# Altium schematic sheet homecomputer-6502_3.SchDoc: homecomputer-6502
size 286 x 202 mm; Date: 2018/12/4 21:08:27; SheetNumber: 4
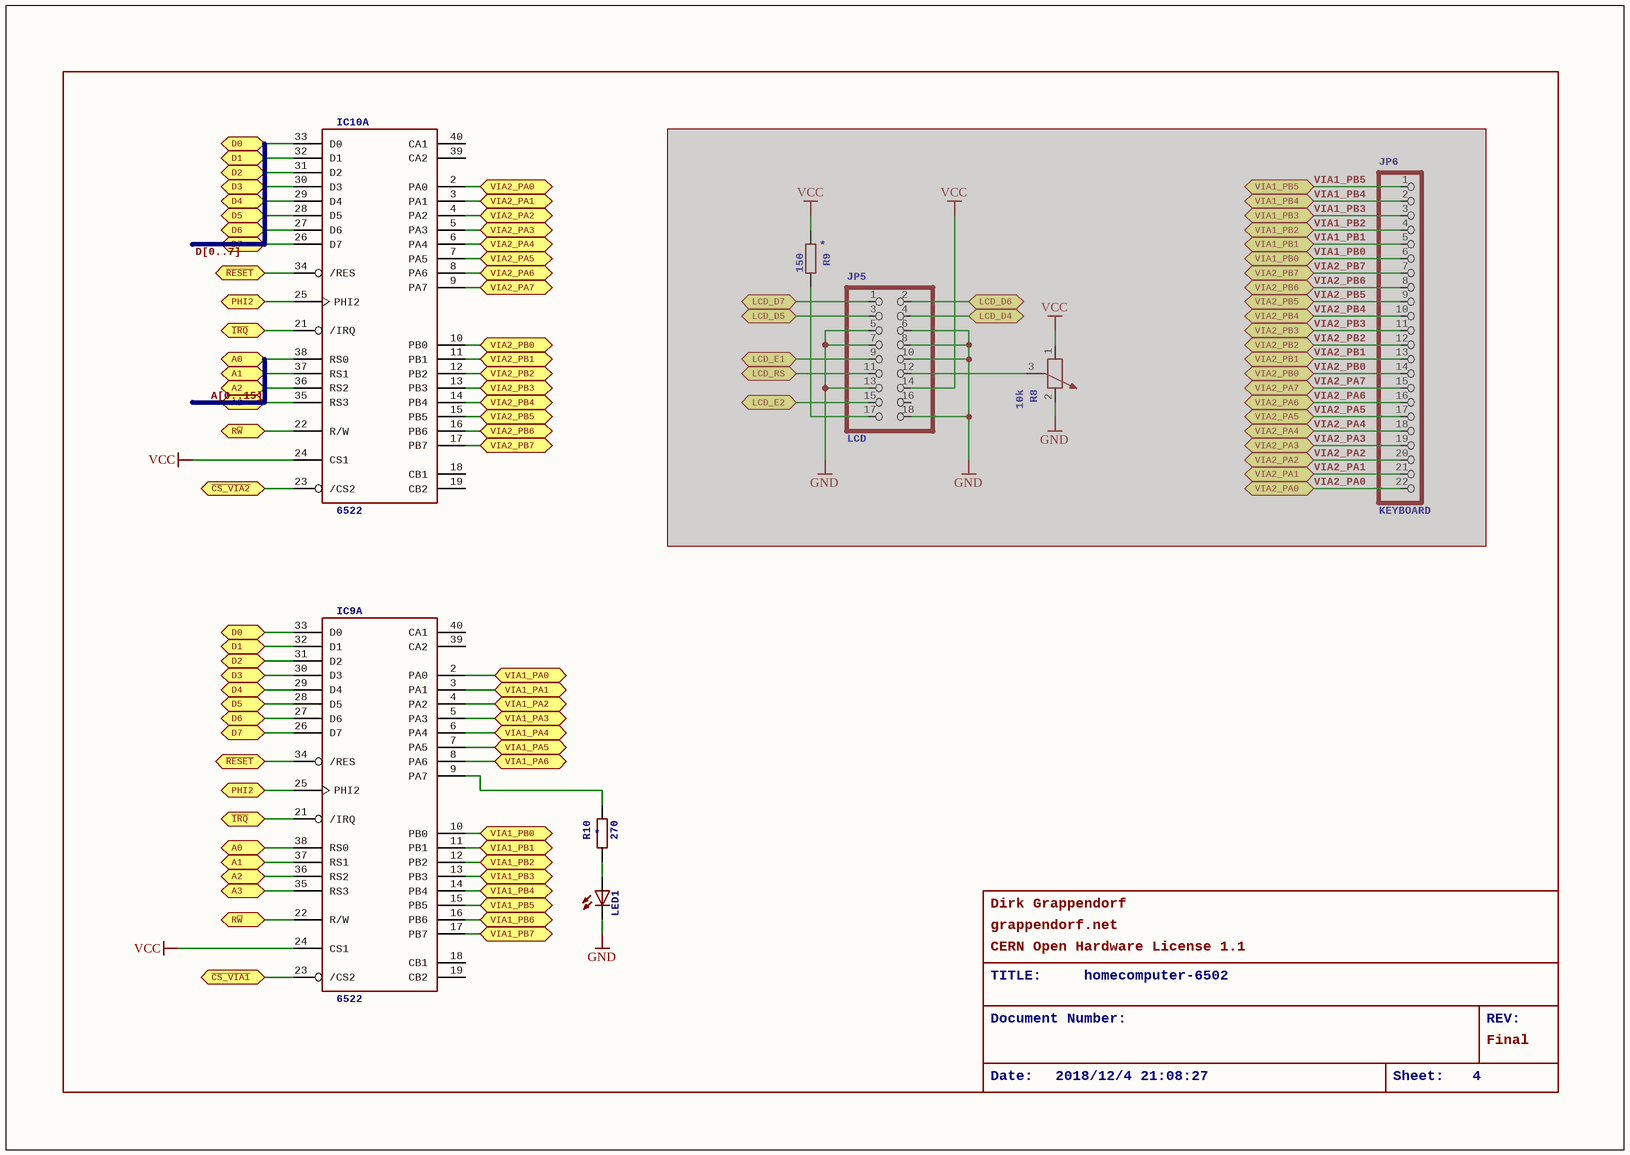
[diagram p0: homecomputer-6502_3.SchDoc]

## Parts
IC9  6522  [DIP40]  (part A of 2)
IC10  6522  [DIP40]  (part A of 2)
JP5  LCD  [2X09]  (masked out: inside a compile mask, not in the netlist)
JP6  KEYBOARD  [1X22]  (masked out: inside a compile mask, not in the netlist)
LED1  LED3MM  [LED3MM]  (value not drawn)
R8  10k  [PT-10]  (masked out: inside a compile mask, not in the netlist)
R9  150  [0204/7]  (masked out: inside a compile mask, not in the netlist)
R10  270  [0204/7]

## Ports
A0, A1, A2, A3, D0, D1, D2, D3, D4, D5, D6, D7, LCD_D4, LCD_D5, LCD_D6, LCD_D7, LCD_E1, LCD_E2, LCD_RS, PHI2, R~{W}, VIA1_PA0, VIA1_PA1, VIA1_PA2, VIA1_PA3, VIA1_PA4, VIA1_PA5, VIA1_PA6, VIA1_PB0, VIA1_PB1, VIA1_PB2, VIA1_PB3, VIA1_PB4, VIA1_PB5, VIA1_PB6, VIA1_PB7, VIA2_PA0, VIA2_PA1, VIA2_PA2, VIA2_PA3, VIA2_PA4, VIA2_PA5, VIA2_PA6, VIA2_PA7, VIA2_PB0, VIA2_PB1, VIA2_PB2, VIA2_PB3, VIA2_PB4, VIA2_PB5, VIA2_PB6, VIA2_PB7, ~{CS_VIA1}, ~{CS_VIA2}, ~{IRQ}, ~{RESET}

## Nets
GND: LED1.K(C)
VCC: IC9.24(CS1) IC10.24(CS1)
A0: IC9.38(RS0) IC10.38(RS0) ; port A0
A1: IC9.37(RS1) IC10.37(RS1) ; port A1
A3: IC9.35(RS3) IC10.35(RS3) ; port A3
A[0..15]: IC9.36(RS2) IC10.36(RS2) ; port A2
~{CS_VIA1}: IC9.23(/CS2) ; port ~{CS_VIA1}
~{CS_VIA2}: IC10.23(/CS2) ; port ~{CS_VIA2}
D0: IC9.33(D0) IC10.33(D0) ; port D0
D1: IC9.32(D1) IC10.32(D1) ; port D1
D2: IC9.31(D2) IC10.31(D2) ; port D2
D3: IC9.30(D3) IC10.30(D3) ; port D3
D4: IC9.29(D4) IC10.29(D4) ; port D4
D5: IC9.28(D5) IC10.28(D5) ; port D5
D6: IC9.27(D6) IC10.27(D6) ; port D6
D7: IC9.26(D7) IC10.26(D7) ; port D7
~{IRQ}: IC9.21(/IRQ) IC10.21(/IRQ) ; port ~{IRQ}
PHI2: IC9.25(PHI2) IC10.25(PHI2) ; port PHI2
~{RESET}: IC9.34(/RES) IC10.34(/RES) ; port ~{RESET}
R~{W}: IC9.22(R/W) IC10.22(R/W) ; port R~{W}
VIA1_PA0: IC9.2(PA0) ; port VIA1_PA0
VIA1_PA1: IC9.3(PA1) ; port VIA1_PA1
VIA1_PA2: IC9.4(PA2) ; port VIA1_PA2
VIA1_PA3: IC9.5(PA3) ; port VIA1_PA3
VIA1_PA4: IC9.6(PA4) ; port VIA1_PA4
VIA1_PA5: IC9.7(PA5) ; port VIA1_PA5
VIA1_PA6: IC9.8(PA6) ; port VIA1_PA6
VIA1_PB0: IC9.10(PB0) ; port VIA1_PB0
VIA1_PB1: IC9.11(PB1) ; port VIA1_PB1
VIA1_PB2: IC9.12(PB2) ; port VIA1_PB2
VIA1_PB3: IC9.13(PB3) ; port VIA1_PB3
VIA1_PB4: IC9.14(PB4) ; port VIA1_PB4
VIA1_PB5: IC9.15(PB5) ; port VIA1_PB5
VIA1_PB6: IC9.16(PB6) ; port VIA1_PB6
VIA1_PB7: IC9.17(PB7) ; port VIA1_PB7
VIA2_PA0: IC10.2(PA0) ; port VIA2_PA0
VIA2_PA1: IC10.3(PA1) ; port VIA2_PA1
VIA2_PA2: IC10.4(PA2) ; port VIA2_PA2
VIA2_PA3: IC10.5(PA3) ; port VIA2_PA3
VIA2_PA4: IC10.6(PA4) ; port VIA2_PA4
VIA2_PA5: IC10.7(PA5) ; port VIA2_PA5
VIA2_PA6: IC10.8(PA6) ; port VIA2_PA6
VIA2_PA7: IC10.9(PA7) ; port VIA2_PA7
VIA2_PB0: IC10.10(PB0) ; port VIA2_PB0
VIA2_PB1: IC10.11(PB1) ; port VIA2_PB1
VIA2_PB2: IC10.12(PB2) ; port VIA2_PB2
VIA2_PB3: IC10.13(PB3) ; port VIA2_PB3
VIA2_PB4: IC10.14(PB4) ; port VIA2_PB4
VIA2_PB5: IC10.15(PB5) ; port VIA2_PB5
VIA2_PB6: IC10.16(PB6) ; port VIA2_PB6
VIA2_PB7: IC10.17(PB7) ; port VIA2_PB7
NetIC9_9: IC9.9(PA7) R10.2
NetLED1_A: LED1.A R10.1

Not connected (* = marked no-connect by the designer): IC9 18(CB1) 19(CB2) 39(CA2) 40(CA1); IC10 18(CB1) 19(CB2) 39(CA2) 40(CA1)

## Buses and harness runs
bus D[0..7]

## Notes on the sheet
- Dirk Grappendorf
- grappendorf.net
- CERN Open Hardware License 1.1
- TITLE:
- Document Number:
- homecomputer-6502
- REV:
- Date:
- 2018/12/4 21:08:27
- Sheet:
- 4
- Final

## Library data of the parts
IC9 IC10 = 6522: I/O device: two 8-bits ports, handshake lines, timers.
JP5 = PINHD-2X9_2.54: PIN HEADER
JP6 = PINHD-1X22_2.54: PIN HEADER
LED1 = LED3MM: LED   OSRAM: - CHIPLED LG R971, LG N971, LY N971, LG Q971, LY Q971, LO R971, LY R971 LH N974, LH R974 LS Q976, LO Q976, LY Q976 LO Q996 - Hyper CHIPLED LW Q18S LB Q993, LB Q99A, LB R99A - SideLED LS A670, LO A670, LY A670, LG A670, LP A670 LB A673, LV A673, LT A673, LW A673 LH A674 LY A675 LS A676, LA A676, LO A676, LY A676, LW A676 LS A679, LY A679, LG A679 -  Hyper Micro SIDELED庐 LS Y876, LA Y876, LO Y876, LY Y876 LT Y87S - SmartLED LW L88C, LW L88S LB L89C, LB L89S, LG L890 LS L89K, LO L89K, LY L89K LS L896, LA L896, LO L896, LY L896 - TOPLED LS T670, LO T670, LY T670, LG T670, LP T670 LSG T670, LSP T670, LSY T670, LOP T670, LYG T670 LG T671, LOG T671, LSG T671 LB T673, LV T673, LT T673, LW T673 LH T674 LS T676, LA T676, LO T676, LY T676, LB T676, LH T676, LSB T676, LW T676 LB T67C, LV T67C, LT T67C, LS T67K, LO T67K, LY T67K, LW E67C LS E67B, LA E67B, LO E67B, LY E67B, LB E67C, LV E67C, LT E67C LW T67C LS T679, LY T679, LG T679 LS T770, LO T770, LY T770, LG T770, LP T770 LB T773, LV T773, LT T773, LW T773 LH T774 LS E675, LA E675, LY E675, LS T675 LS T776, LA T776, LO T776, LY T776, LB T776 LHGB T686 LT T68C, LB T68C - Hyper Mini TOPLED庐 LB M676 - Mini TOPLED Santana庐 LG M470 LS M47K, LO M47K, LY M47K    Source: http://www.osram.convergy.de   LUXEON: - LUMILED庐 LXK2-PW12-R00, LXK2-PW12-S00, LXK2-PW14-U00, LXK2-PW14-V00 LXK2-PM12-R00, LXK2-PM12-S00, LXK2-PM14-U00 LXK2-PE12-Q00, LXK2-PE12-R00, LXK2-PE12-S00, LXK2-PE14-T00, LXK2-PE14-U00 LXK2-PB12-K00, LXK2-PB12-L00, LXK2-PB12-M00, LXK2-PB14-N00, LXK2-PB14-P00, LXK2-PB14-Q00 LXK2-PR12-L00, LXK2-PR12-M00, LXK2-PR14-Q00, LXK2-PR14-R00 LXK2-PD12-Q00, LXK2-PD12-R00, LXK2-PD12-S00 LXK2-PH12-R00, LXK2-PH12-S00 LXK2-PL12-P00, LXK2-PL12-Q00, LXK2-PL12-R00    Source: www.luxeon.com   KINGBRIGHT:   KA-3528ASYC Source: www.kingbright.com
R8 = POTENTIOMETER_PT-10: Potentiometer
R9 R10 = R-EU_0204/7: RESISTOR, European symbol; NAME: *